# EAGLE schematic segmentring4und8 (EAGLE 7.2.0)
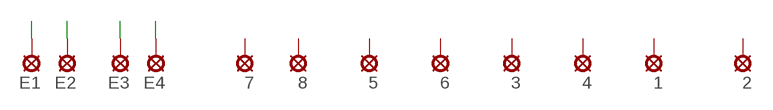
[diagram p0: schematic, sheet 1]

## Parts
1  SE14  [SE14]
2  SE14  [SE14]
3  SE14  [SE14]
4  SE14  [SE14]
5  SE14  [SE14]
6  SE14  [SE14]
7  SE14  [SE14]
8  SE14  [SE14]
E1  SE14  [SE14]
E2  SE14  [SE14]
E3  SE14  [SE14]
E4  SE14  [SE14]

## Nets
N$4: E1.MP
N$5: E2.MP
N$6: E3.MP
N$7: E4.MP
Unconnected: 1.MP 2.MP 3.MP 4.MP 5.MP 6.MP 7.MP 8.MP

## Library data of the parts
1-8 E1-E4 = solpad:SE14: SOLDER PAD E1553, drill 1,4mm, distributor Buerklin, 07F820